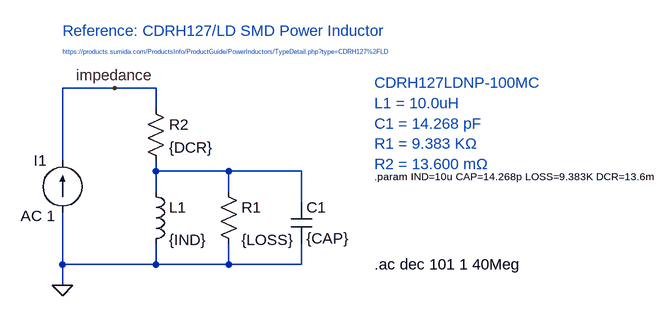
[diagram p0: schematic 02-CDRH127-LDNP-100MC_linear_model.asc]
02-CDRH127-LDNP-100MC_linear_model.asc, the LTspice schematic file:
Version 4
SHEET 1 1168 680
WIRE 48 64 -32 64
WIRE 112 64 48 64
WIRE 112 96 112 64
WIRE -32 176 -32 64
WIRE 112 192 112 176
WIRE 224 192 112 192
WIRE 336 192 224 192
WIRE 112 224 112 192
WIRE 224 224 224 192
WIRE 336 240 336 192
WIRE -32 336 -32 256
WIRE 112 336 112 304
WIRE 112 336 -32 336
WIRE 224 336 224 304
WIRE 224 336 112 336
WIRE 336 336 336 304
WIRE 336 336 224 336
WIRE -32 368 -32 336
FLAG -32 368 0
FLAG 48 64 impedance
SYMBOL res 96 80 R0
SYMATTR InstName R2
SYMATTR Value {DCR}
SYMBOL ind 96 208 R0
WINDOW 3 36 90 Left 2
SYMATTR InstName L1
SYMATTR Value {IND}
SYMBOL cap 320 240 R0
SYMATTR InstName C1
SYMATTR Value {CAP}
SYMBOL res 208 208 R0
WINDOW 3 36 90 Left 2
SYMATTR InstName R1
SYMATTR Value {LOSS}
SYMBOL current -32 256 R180
WINDOW 0 24 80 Left 2
WINDOW 3 24 0 Left 2
WINDOW 123 11 -5 Left 2
WINDOW 39 0 0 Left 0
SYMATTR InstName I1
SYMATTR Value ""
SYMATTR Value2 AC 1
TEXT 448 336 Left 2 !.ac dec 101 1 40Meg
TEXT -32 -24 Left 2 ;Reference: CDRH127/LD SMD Power Inductor
TEXT -32 8 Left 0 ;https://products.sumida.com/ProductsInfo/ProductGuide/PowerInductors/TypeDetail.php?type=CDRH127%2FLD
TEXT 448 56 Left 2 ;CDRH127LDNP-100MC\nL1 = 10.0uH\nC1 = 14.268 pF\nR1 = 9.383 KΩ\nR2 = 13.600 mΩ
TEXT 448 200 Left 1 !.param IND=10u CAP=14.268p LOSS=9.383K DCR=13.6m

The netlist it stands for:
* 02-CDRH127-LDNP-100MC_linear_model.asc
R2 impedance N001 {DCR}
L1 N001 0 {IND}
C1 N001 0 {CAP}
R1 N001 0 {LOSS}
I1 0 impedance AC 1
.ac dec 101 1 40Meg
* Reference: CDRH127/LD SMD Power Inductor
* https://products.sumida.com/ProductsInfo/ProductGuide/PowerInductors/TypeDetail.php?type=CDRH127%2FLD
* CDRH127LDNP-100MC
* L1 = 10.0uH
* C1 = 14.268 pF
* R1 = 9.383 KΩ
* R2 = 13.600 mΩ
.param IND=10u CAP=14.268p LOSS=9.383K DCR=13.6m
.backanno
.end

* Results of the author's LTspice run, read from the files saved beside the schematic
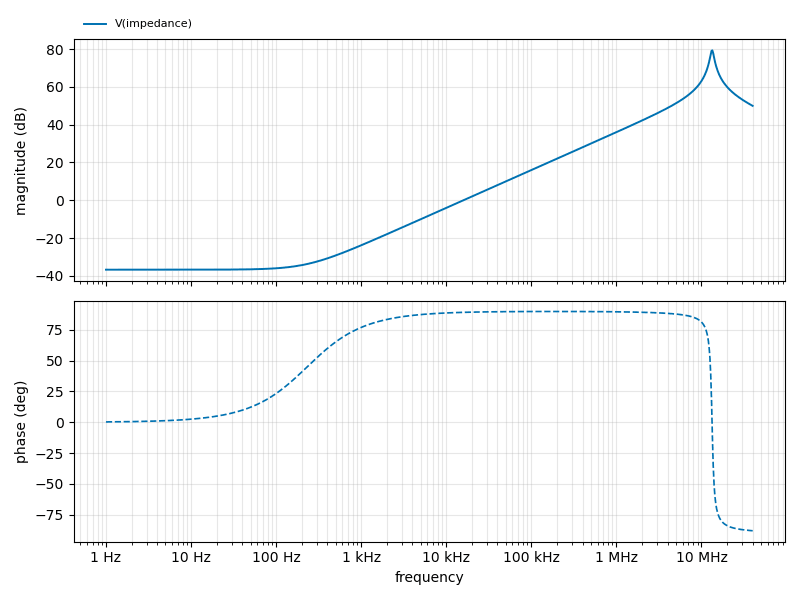
[diagram p1: AC Analysis of 02-CDRH127-LDNP-100MC_linear_model.asc, plotted from the saved traces]
* AC Analysis, 1 run:
*   V(impedance): -36.71 dB at 1 Hz, 49.92 dB at 40 MHz, peak 79.26 dB at 13.45 MHz, 3 dB below the peak at 12.72 MHz and 13.96 MHz